# Altium schematic sheet DC_DETECT.SchDoc
size A4
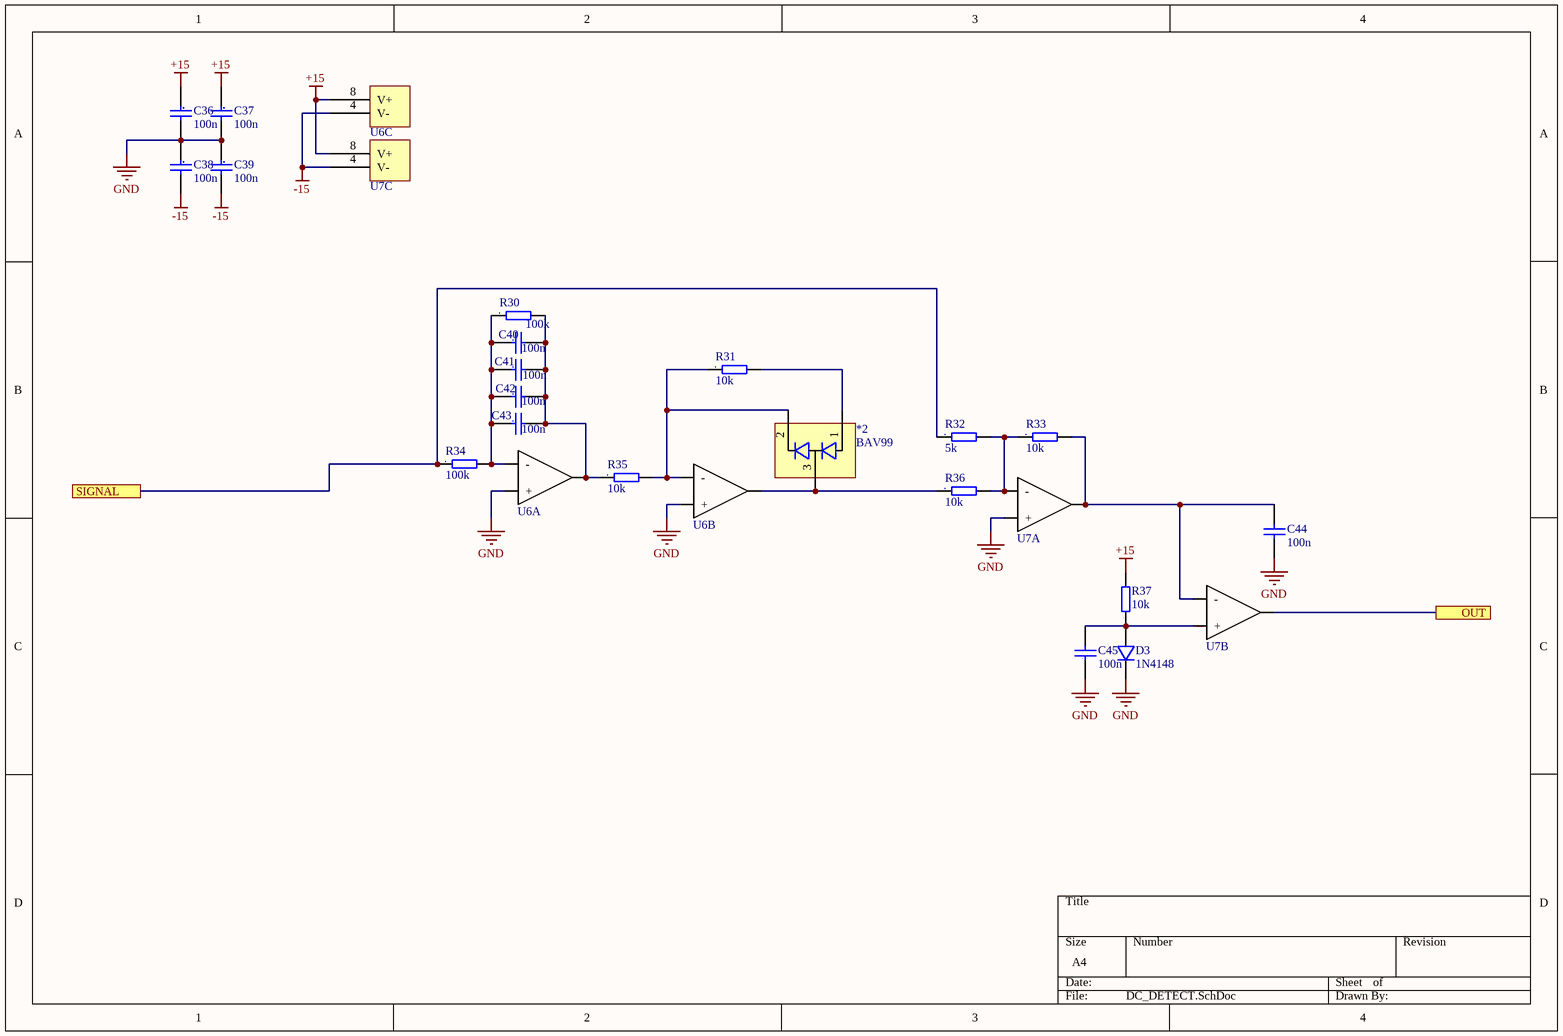
[diagram p0: DC_DETECT.SchDoc]

## Parts
*2  BAV99  [SOT23_123_N]
C36  100n  [C0603_N]
C37  100n  [C0603_N]
C38  100n  [C0603_N]
C39  100n  [C0603_N]
C40  100n  [C0603_N]
C41  100n  [C0603_N]
C42  100n  [C0603_N]
C43  100n  [C0603_N]
C44  100n  [C0603_N]
C45  100n  [C0603_N]
D3  1N4148  [SOD-80]
R30  100k  [R0603_N]
R31  10k  [R0603_N]
R32  5k  [R0603_N]
R33  10k  [R0603_N]
R34  100k  [R0603_N]
R35  10k  [R0603_N]
R36  10k  [R0603_N]
R37  10k  [R0603_N]
U6  LM258  [SOIC-8]  (value not drawn)  (parts A,B,C of 3)
U7  LM258  [SOIC-8]  (value not drawn)  (parts A,B,C of 3)

## Ports
OUT, SIGNAL

## Nets
+15: C36.1 C37.1 R37.2 U6.8(V+) U7.8(V+)
-15: C38.2 C39.2 U6.4(V-) U7.4(V-)
GND: C36.2 C37.2 C38.1 C39.1 C44.1 C45.1 D3.C U6.3(+) U6.5(+) U7.3(+)
OUT: U7.7(Out) ; port OUT
SIGNAL: R32.1 R34.1 ; port SIGNAL
Net*2_1: *2.1(A) R31.2
Net*2_2: *2.2(C) R31.1 R35.2 U6.6(-)
Net*2_3: *2.3(C/A) R36.1 U6.7(Out)
NetC40_1: C40.1 C41.1 C42.1 C43.1 R30.1 R34.2 U6.2(-)
NetC40_2: C40.2 C41.2 C42.2 C43.2 R30.2 R35.1 U6.1(Out)
NetC44_2: C44.2 R33.2 U7.1(Out) U7.6(-)
NetC45_2: C45.2 D3.A R37.1 U7.5(+)
NetR32_2: R32.2 R33.1 R36.2 U7.2(-)

## Library data of the parts
C36-C45 = CAP: RevS: $Rev:: 58        $
D3 = DIODE
R30-R37 = RES
U6 U7 = LM258: Dual op. amp., 3..36V, Iq=300uA